# EasyEDA Pro project HUB75.eprj

# Schematic Schematic1
Board Name: Board1; Create Date: 2025-05-24; Page Name: P1; Project Name: HUB75; Schematic Name: Schematic1; Update Date: 2025-05-31; Company: 嘉立创EDA; Page Size: A4; Version: V1.0
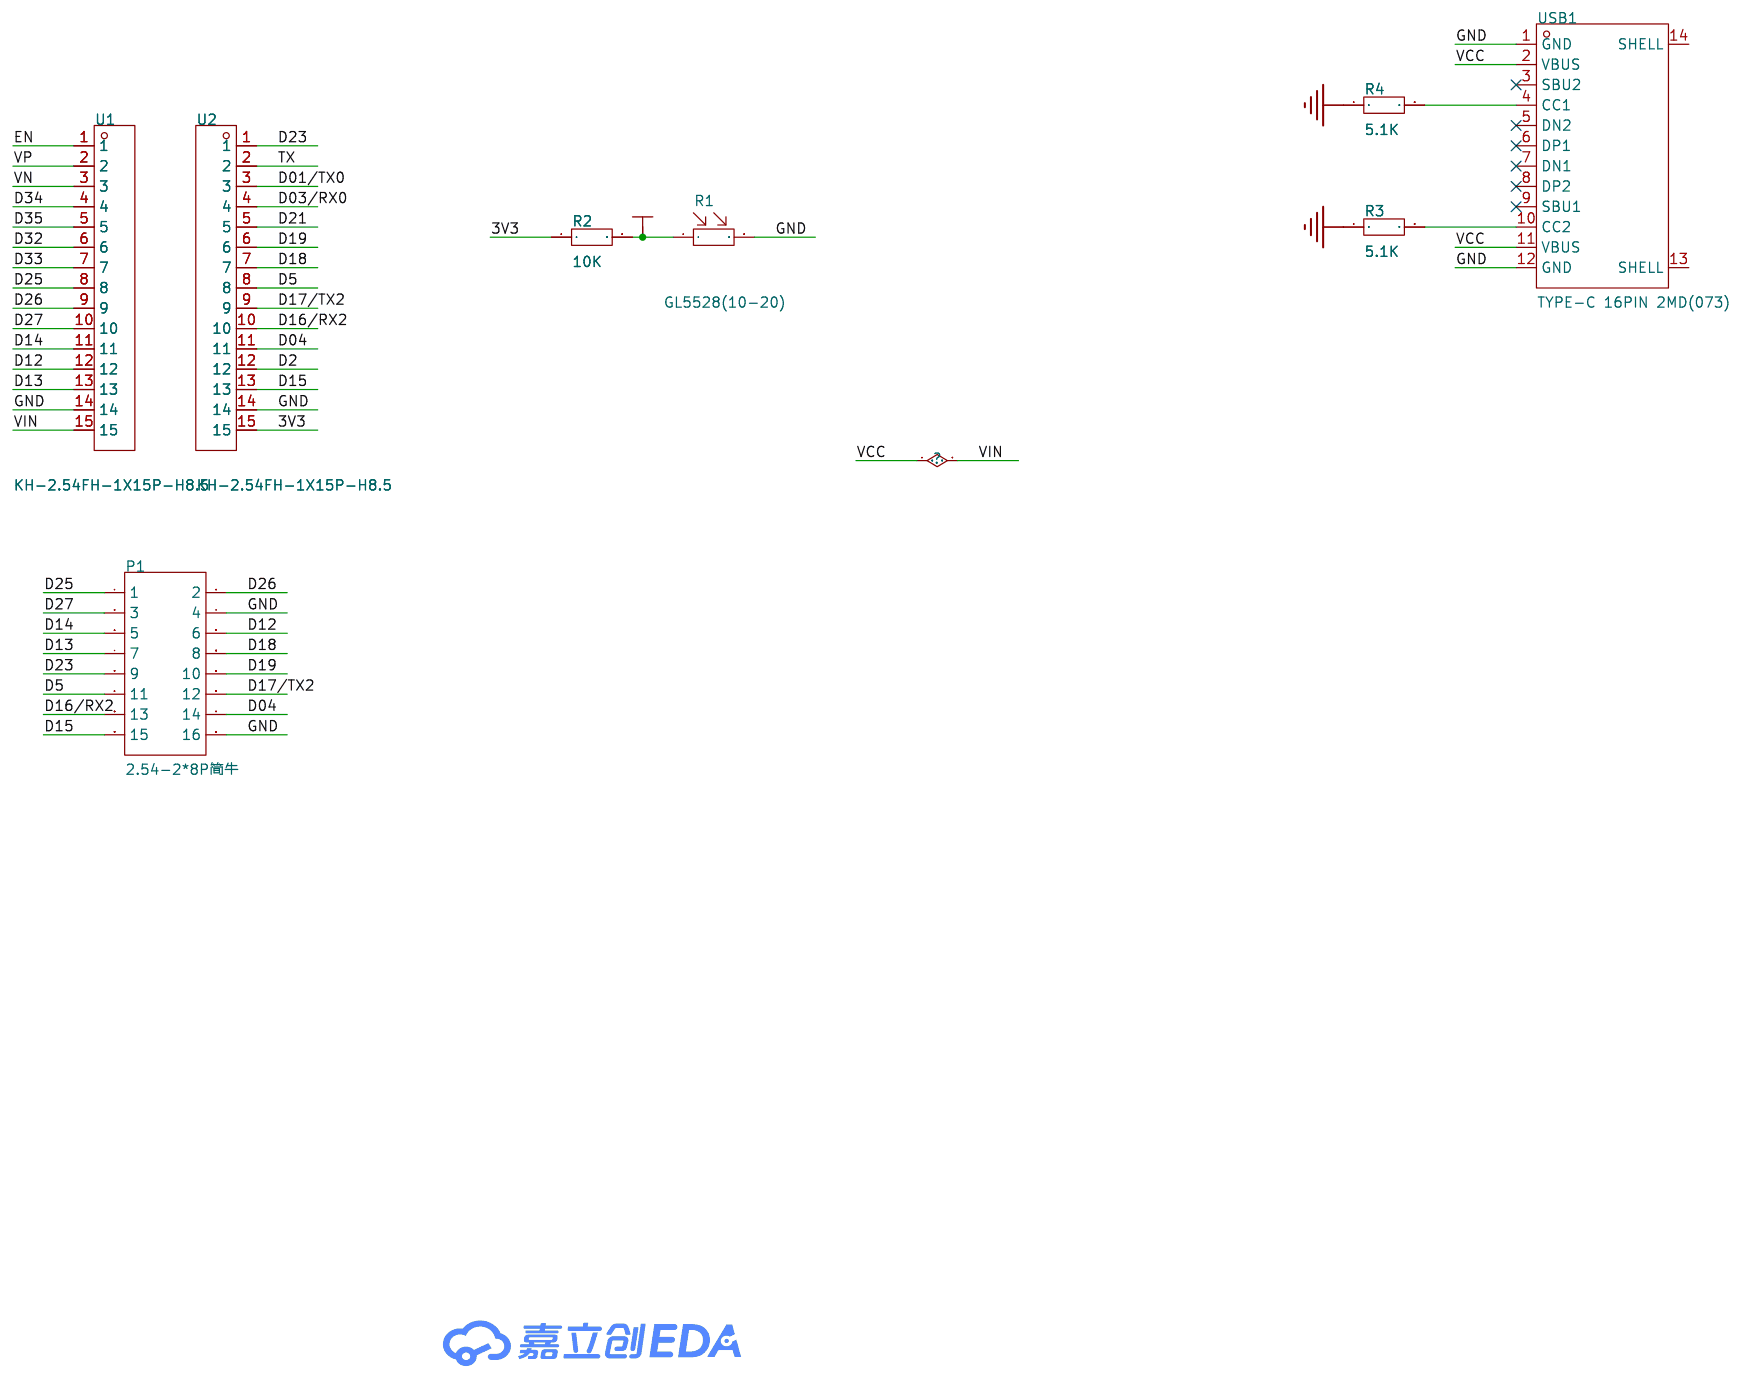
[diagram p0: schematic sheet]

## Parts
P1  2.54-2*8P简牛  [IDC-TH_16P-P2.54_C3406]
R1  GL5528(10-20)  [RES-TH_L5.1-W4.3-P3.40-D0.5]
R2  10K  [R0603]
R3  5.1K  [R0603]
R4  5.1K  [R0603]
U1  KH-2.54FH-1X15P-H8.5  [HDR-TH_15P-P2.54-V-F]
U2  KH-2.54FH-1X15P-H8.5  [HDR-TH_15P-P2.54-V-F]
USB1  TYPE-C 16PIN 2MD(073)  [USB-C-SMD_TYPE-C-6PIN-2MD-073]

## Library data of the parts
P1 = 2.54-2*8P简牛: LCSC Part Name: 2.54mm 2x8P 排数:2 每排P数:8; Supplier Part: C3406; Manufacturer: BOOMELE(博穆精密); Supplier Footprint: 插件,P=2.54mm; JLCPCB Part Class: 扩展库; Datasheet: https://atta.szlcsc.com/upload/public/pdf/source/20131122/1457706661483.pdf; Supplier: LCSC; Connector Type: 简牛座; Pitch: 2.54mm; Structure: 2x8P; Holder Type: 直插; Row Spacing: 2.54mm; Number of Rows: 2; Pin Number in each Row: 8
R1 = GL5528(10-20)_C10081: Supplier Part: C10081; Manufacturer: JCHL(晶创和立); Supplier Footprint: 插件,P=3.4mm; JLCPCB Part Class: 扩展库; Datasheet: https://atta.szlcsc.com/upload/public/pdf/source/20200417/C515010_C10502EF7F431E893A7F20DB83F527F0.pdf; Supplier: LCSC; Dark Resistance: 1MΩ; Cell Resistance @ Illuminance: 10kΩ~20kΩ; Voltage - Max: 150V; Wavelength - Peak: 540nm
R2-R4 = Res_0603: Supplier Footprint: 0603
U1 U2 = KH-2.54FH-1X15P-H8.5: LCSC Part Name: 间距:2.54mm 1x15P 直插; Supplier Part: C2932676; Manufacturer: kinghelm(金航标); Supplier Footprint: 插件,P=2.54mm; JLCPCB Part Class: 扩展库; Datasheet: https://atta.szlcsc.com/upload/public/pdf/source/20211220/977AA415CFA981E866620A80068F25CA.pdf; Supplier: LCSC; Holes Structure: 1x15P; Pitch: 2.54mm; Circular Hole / Square Hole: 方孔; Mounting Type: 直插; Number of Rows: 单排; Number of Holes: 15P; Current Rating (Max): 3A; Holes Direction: 顶部; Insulation Height: 8.5mm; Operating Temperature Range: -40℃~+105℃
USB1 = TYPE-C 16PIN 2MD(073): LCSC Part Name: Type-C 母 卧贴; Supplier Part: C2765186; Manufacturer: SHOU HAN(首韩); Supplier Footprint: SMD; Datasheet: https://atta.szlcsc.com/upload/public/pdf/source/20211123/39B17C16241EAC15C5E277BDA434118E.pdf; Supplier: LCSC; Connector Type: Type-C; Standard: USB 3.1; Gender: 母; Mounting Style: 卧贴; Number of Contacts: 16P; Number of Ports: 1; Current Rating - Power (Max): 5A; Operating Temperature Range: -25℃~+85℃; Rated Voltage (Max): 5V; Connect-Disconnect Life: 5千次; Core Colour: 黑色

## Nets
3V3: R2.1 U2.15
GND: P1.4 P1.16 R1.2 R3.1 R4.1 U1.14 U2.14 USB1.1(GND) USB1.12(GND)
VCC: U1.15 USB1.2(VBUS) USB1.11(VBUS)
D01/TX0: U2.3
D2: U2.12
D03/RX0: U2.4
D04: P1.14 U2.11
D5: P1.11 U2.8
D12: P1.6 U1.12
D13: P1.7 U1.13
D14: P1.5 U1.11
D15: P1.15 U2.13
D16/RX2: P1.13 U2.10
D17/TX2: P1.12 U2.9
D18: P1.8 U2.7
D19: P1.10 U2.6
D21: U2.5
D23: P1.9 U2.1
D25: P1.1 U1.8
D26: P1.2 U1.9
D27: P1.3 U1.10
D32: U1.6
D33: U1.7
D34: U1.4
D35: R1.1 R2.2 U1.5
EN: U1.1
TX: U2.2
VN: U1.3
VP: U1.2
$1N2046: R3.2 USB1.10(CC2)
$1N2050: R4.2 USB1.4(CC1)

Not connected (* = marked no-connect by the designer): USB1 3(SBU2)* 5(DN2)* 6(DP1)* 7(DN1)* 8(DP2)* 9(SBU1)* 13(SHELL) 14(SHELL)

# Board PCB1
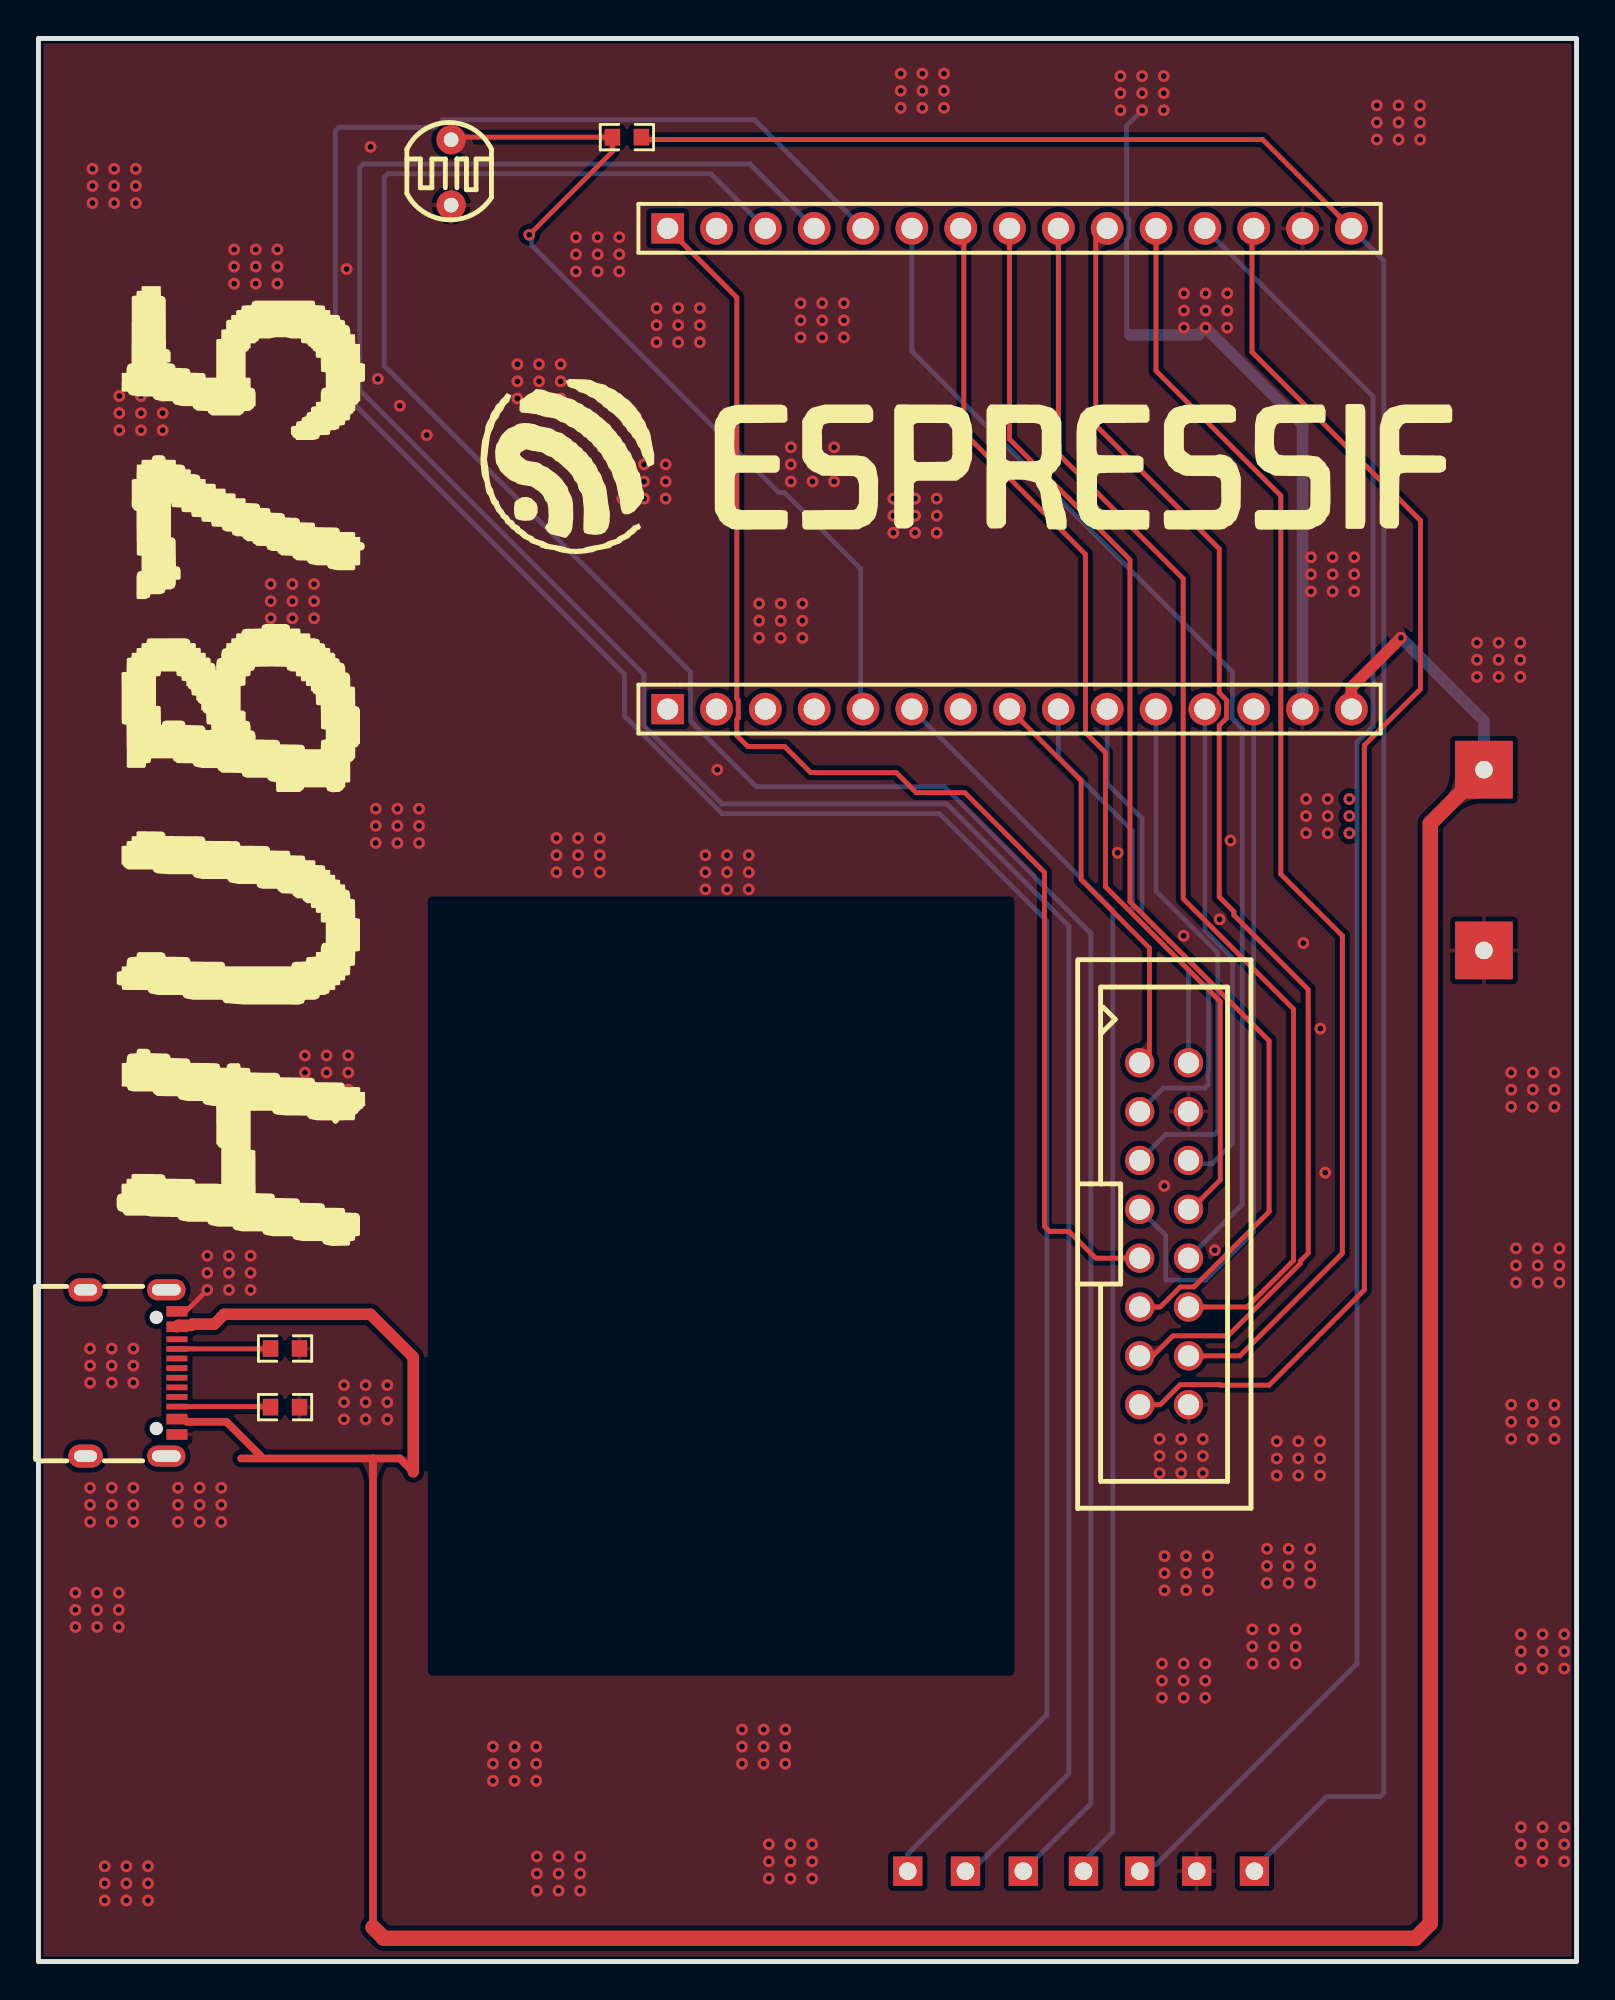
[diagram p1: board, top side]
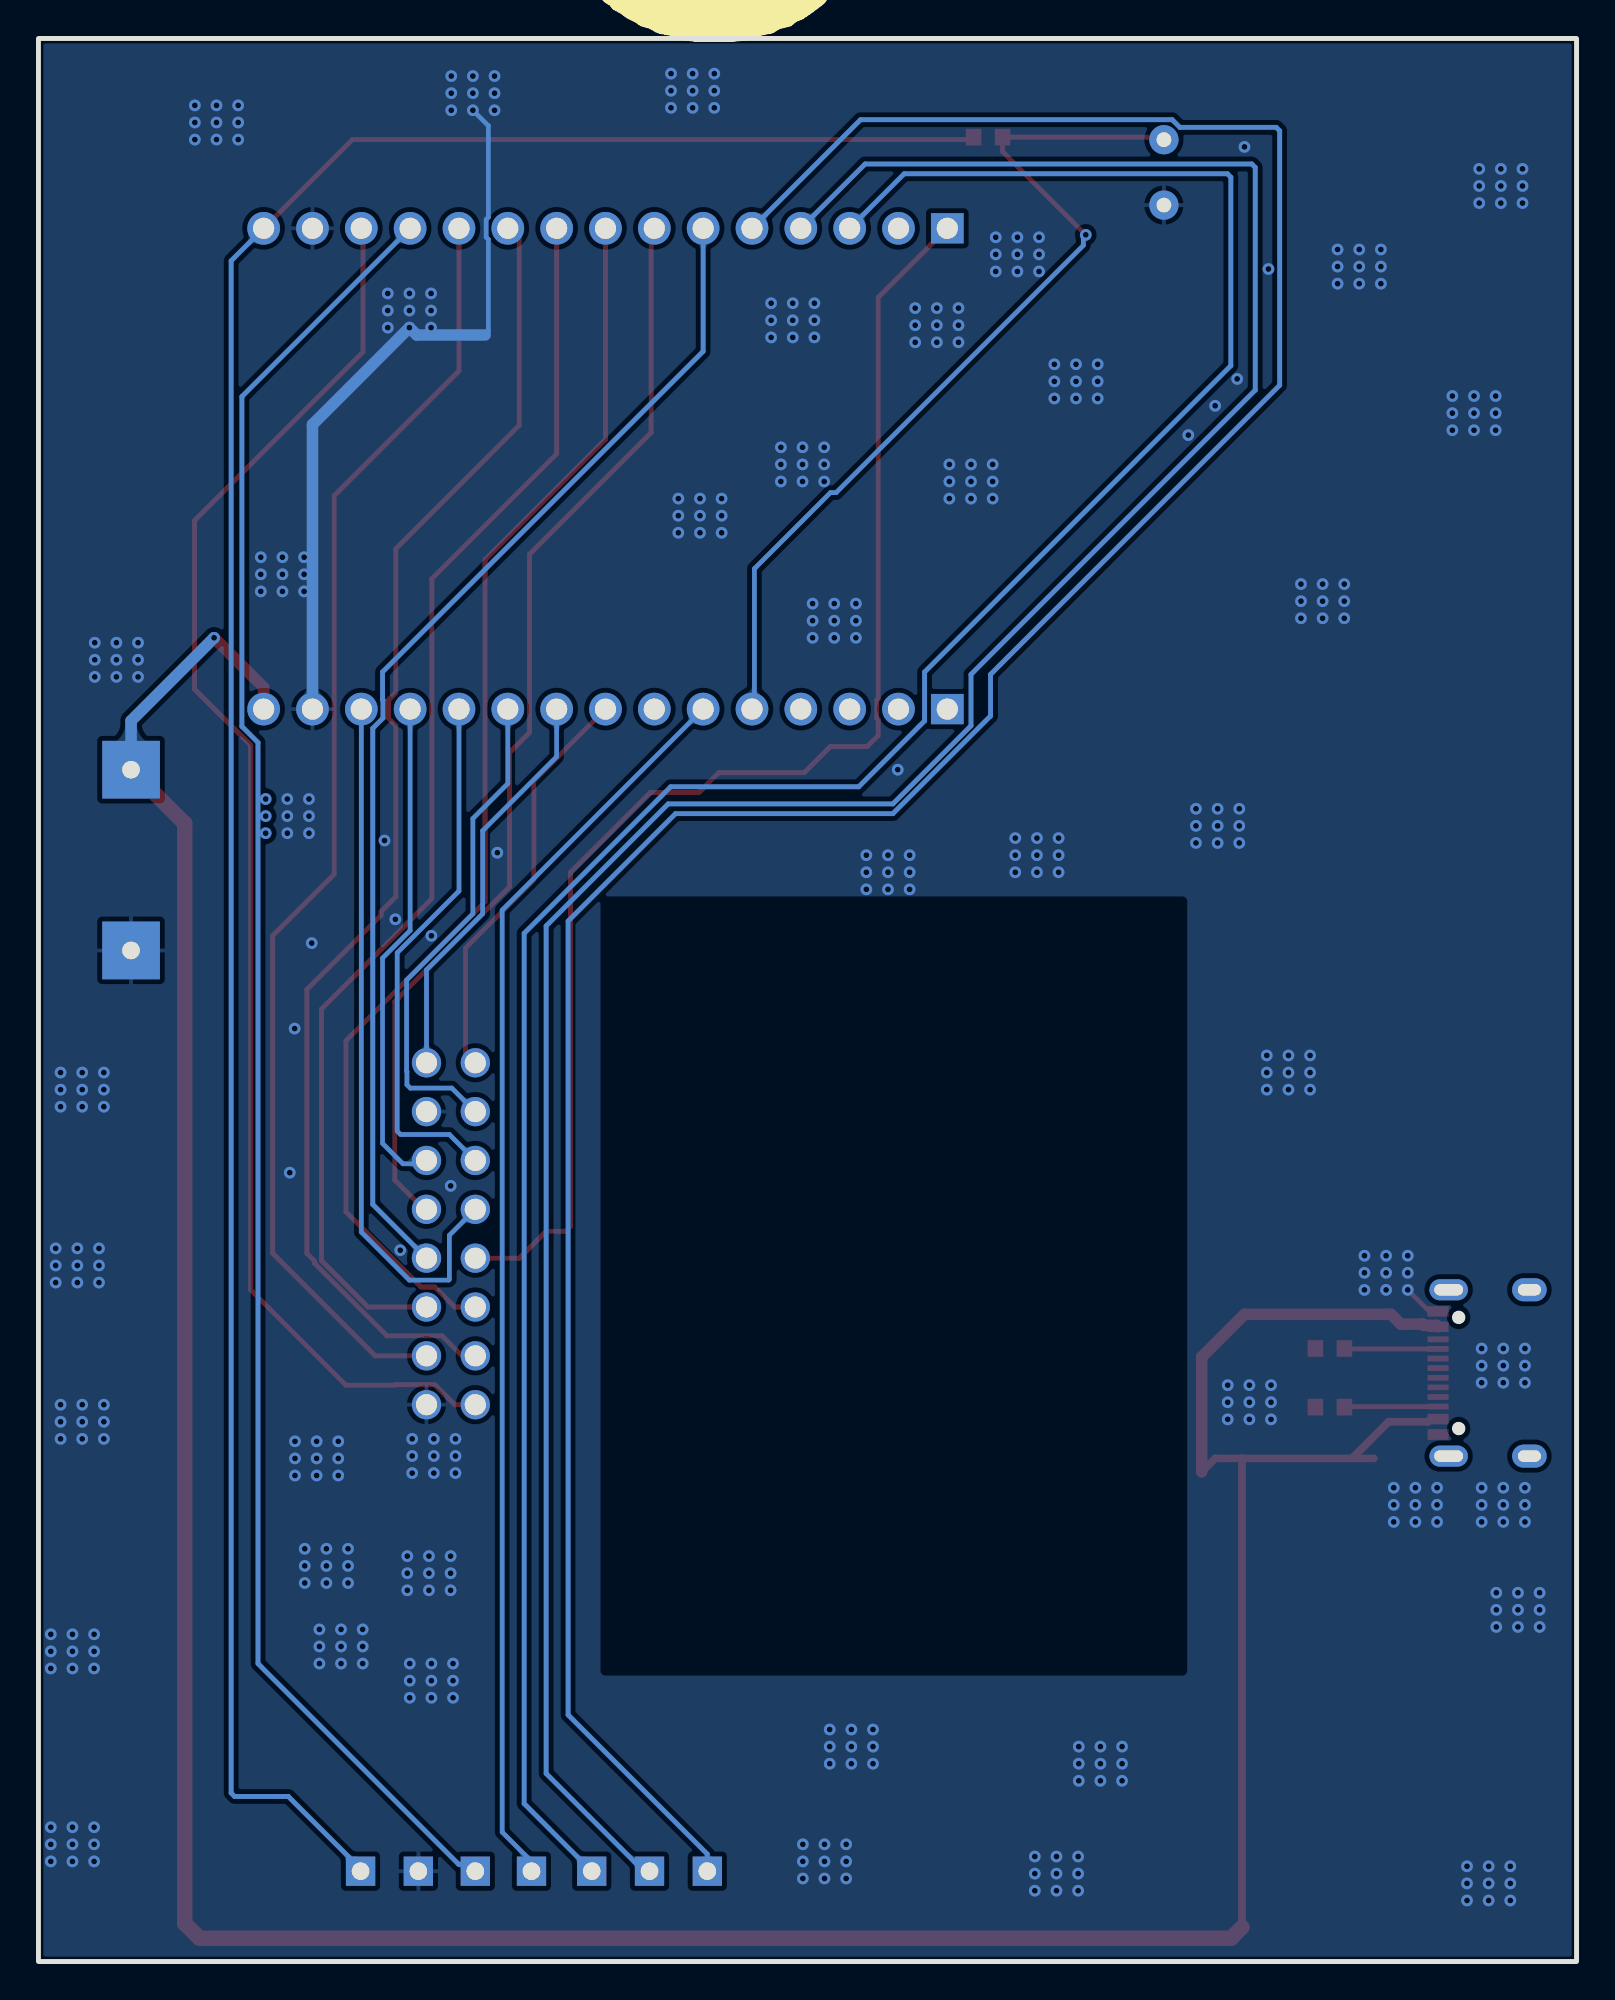
[diagram p2: board, bottom side, seen from below]

Outline 80 x 100 mm; copper layers: Top Layer, Bottom Layer. Coordinates in mm from the lower left corner of the outline.
Outline path: rectangle 0,100 80,0
Stack: Top Layer 0.035mm / Dielectric1 1.51mm FR4 er 4.5 / Bottom Layer 0.035mm

## Design rules (mm)
template: JLCPCB Capability(Two Layers Board)
spacing copperThickness1oz (default): track to track 0.102, other pairs 0.152 to 0.3
spacing copperThickness2oz: track to track 0.203, other pairs 0.152 to 0.3
track width copperThickness1oz (default): min 0.127, default 0.254, max 2.54
track width copperThickness2oz: min 0.203, default 0.254, max 2.54
differential pair differentialPair (default): width min 0.127, default 0.254, max 2.54; gap min 0.152, default 0.152
via viaSize (default): diameter min 0.5, default 0.61, max 10; hole min 0.3, default 0.305, max 6.3

## Placement (name value [footprint] x y rotation side)
NOREF  -  [Pad_e1176]  75.18 52.58 0 top
NOREF#2  -  [Pad_e431]  48.22 4.7 0 top
NOREF#3  -  [Pad_e436]  60.24 4.7 0 top
NOREF#4  -  [Pad_e515]  63.25 4.7 0 top
NOREF#5  -  [Pad_e433]  54.36 4.7 0 top
NOREF#6  -  [Pad_e435]  57.28 4.7 0 top
NOREF#7  -  [Pad_e429]  45.21 4.7 0 top
NOREF#8  -  [Pad_e432]  51.22 4.7 0 top
NOREF#9  -  [Pad_e1168]  75.18 61.98 0 top
P1  2.54-2*8P简牛  [IDC-TH_16P-P2.54_C3406]  58.55 37.85 270 top
R1  GL5528(10-20)  [RES-TH_L5.1-W4.3-P3.40-D0.5]  21.46 93.04 0 top
R2  10K  [R0603]  30.61 94.87 180 top
R3  5.1K  [R0603]  12.83 28.83 180 top
R4  5.1K  [R0603]  12.83 31.88 180 top
U1  KH-2.54FH-1X15P-H8.5  [HDR-TH_15P-P2.54-V-F]  50.51 65.13 0 top
U2  KH-2.54FH-1X15P-H8.5  [HDR-TH_15P-P2.54-V-F]  50.51 90.13 0 top
USB1  TYPE-C 16PIN 2MD(073)  [USB-C-SMD_TYPE-C-6PIN-2MD-073]  4.83 30.61 270 top

## Footprints (pads in the part's own frame, mm; a bottom-side part is the same pattern mirrored in y, then rotated)
HDR-TH_15P-P2.54-V-F
  rect 1.7x1.575 hole 1.1: 1(-17.78,0)
  round 1.7 hole 1.1: 2(-15.24,0) 3(-12.7,0) 4(-10.16,0) 5(-7.62,0) 6(-5.08,0) 7(-2.54,0) 8(0,0) 9(2.54,0) 10(5.08,0) 11(7.62,0) 12(10.16,0) 13(12.7,0) 14(15.24,0) 15(17.78,0)
IDC-TH_16P-P2.54_C3406
  round 1.524 hole 1.1: 1(-8.89,-1.27) 2(-8.89,1.27) 3(-6.35,-1.27) 4(-6.35,1.27) 5(-3.81,-1.27) 6(-3.81,1.27) 7(-1.27,-1.27) 8(-1.27,1.27) 9(1.27,-1.27) 10(1.27,1.27) 11(3.81,-1.27) 12(3.81,1.27) 13(6.35,-1.27) 14(6.35,1.27) 15(8.89,-1.27) 16(8.89,1.27)
Pad_e429
  rect 1.524x1.524 hole 0.914: 1(0,0)
Pad_e431
  rect 1.524x1.524 hole 0.914: 1(0,0)
Pad_e432
  rect 1.524x1.524 hole 0.914: 1(0,0)
Pad_e433
  rect 1.524x1.524 hole 0.914: 1(0,0)
Pad_e435
  rect 1.524x1.524 hole 0.914: 1(0,0)
Pad_e436
  rect 1.524x1.524 hole 0.914: 1(0,0)
Pad_e515
  rect 1.524x1.524 hole 0.914: 1(0,0)
Pad_e1168
  rect 3x3 hole 0.914: 1(0,0)
Pad_e1176
  rect 3x3 hole 0.914: 1(0,0)
R0603
  rect 0.806x0.864 smd: 1(-0.753,0) 2(0.753,0)
RES-TH_L5.1-W4.3-P3.40-D0.5
  round 1.524 hole 0.762: 1(0,1.7) 2(0,-1.7)
USB-C-SMD_TYPE-C-6PIN-2MD-073
  rect 0.55x1.1 smd: 1(-3.2,2.375) 2(-2.4,2.375) 11(2.4,2.375) 12(3.2,2.375)
  rect 0.3x1.1 smd: 3(-1.75,2.375) 4(-1.25,2.375) 5(-0.75,2.375) 6(-0.25,2.375) 7(0.25,2.375) 8(0.75,2.375) 9(1.25,2.375) 10(1.75,2.375)
  oval 1.1x2 hole 0.6x1.5: 13(-4.325,1.825) 14(4.325,1.825)
  oval 1.2x1.8 hole 0.6x1.2: 13(-4.325,-2.375) 14(4.325,-2.375)

## Nets
3V3: NOREF#4.1 R2.1 U2.15
GND: NOREF.1 NOREF#3.1 P1.4 P1.16 R1.2 R3.1 R4.1 U1.14 U2.14 USB1.1 USB1.12
VCC: NOREF#9.1 U1.15 USB1.2 USB1.11
D01/TX0: NOREF#8.1 U2.3
D2: NOREF#6.1 U2.12
D03/RX0: NOREF#2.1 U2.4
D04: P1.14 U2.11
D5: P1.11 U2.8
D12: P1.6 U1.12
D13: P1.7 U1.13
D14: P1.5 U1.11
D15: P1.15 U2.13
D16/RX2: P1.13 U2.10
D17/TX2: P1.12 U2.9
D18: P1.8 U2.7
D19: P1.10 U2.6
D21: NOREF#7.1 U2.5
D23: P1.9 U2.1
D25: P1.1 U1.8
D26: P1.2 U1.9
D27: P1.3 U1.10
D32: NOREF#5.1 U1.6
D33: U1.7
D34: U1.4
D35: R1.1 R2.2 U1.5
EN: U1.1
TX: U2.2
VN: U1.3
VP: U1.2
$1N2046: R3.2 USB1.10
$1N2050: R4.2 USB1.4

Pads without a net: USB1 3 5 6 7 8 9 13 14

## Via types
v1: diameter 0.61, hole 0.305, Top Layer to Bottom Layer, 422 vias

## Routing (per net, layer and track width the routed paths; a pad name or vN(x,y) marks a point on that pad's centre or on a via; arc(x,y) is an arc through that point)
3V3: length 129.2
  Top Layer w0.254: 31.62,94.74 63.67,94.74 U2.15
  Bottom Layer w0.254: 63.12,4.7 67,8.58 69.8,8.58 69.98,8.76 69.98,88.44 U2.15
GND: length 40.2
  Top Layer w0.245: USB1.1 7.66,33.81 v1(8.78,34.93)
  Bottom Layer w0.245: 56.77,84.58 56.6,84.76 56.6,89.54 56.71,89.66 56.71,90.59 56.6,90.71 56.6,95.46 v1(57.4,96.27)
  Bottom Layer w0.6: 56.77,84.58 60.33,84.58 v1(60.71,84.96) 65.75,79.92 U1.14
  vias: v1(1.92,19.18) v1(1.92,18.29) v1(1.92,17.4) v1(2.68,31.88) v1(2.68,30.99) v1(2.68,30.1) v1(2.68,24.64) v1(2.68,23.75) v1(2.68,22.86) v1(2.81,93.22) v1(2.81,92.33) v1(2.81,91.44) v1(3.05,19.18) v1(3.05,18.29) v1(3.05,17.4) v1(3.45,4.95) v1(3.45,4.06) v1(3.45,3.18) v1(3.81,31.88) v1(3.81,30.99) v1(3.81,30.1) v1(3.81,24.64) v1(3.81,23.75) v1(3.81,22.86) v1(3.94,93.22) v1(3.94,92.33) v1(3.94,91.44) v1(4.21,81.41) v1(4.21,80.52) v1(4.21,79.63) v1(4.17,19.18) v1(4.17,18.29) v1(4.17,17.4) v1(4.57,4.95) v1(4.57,4.06) v1(4.57,3.18) v1(4.94,31.88) v1(4.94,30.99) v1(4.94,30.1) v1(4.94,24.64) v1(4.94,23.75) v1(4.94,22.86) v1(5.06,93.22) v1(5.06,92.33) v1(5.06,91.44) v1(5.33,81.41) v1(5.33,80.52) v1(5.33,79.63) v1(5.7,4.95) v1(5.7,4.06) v1(5.7,3.18) v1(6.46,81.41) v1(6.46,80.52) v1(6.46,79.63) v1(7.26,24.64) v1(7.26,23.75) v1(7.26,22.86) v1(8.38,24.64) v1(8.38,23.75) v1(8.38,22.86) v1(8.78,36.7) v1(8.78,35.81) v1(9.51,24.64) v1(9.51,23.75) v1(9.51,22.86) v1(9.91,36.7) v1(9.91,35.81) v1(9.91,34.93) v1(10.18,89.03) v1(10.18,88.14) v1(10.18,87.25) v1(11.03,36.7) v1(11.03,35.81) v1(11.03,34.93) v1(11.3,89.03) v1(11.3,88.14) v1(11.3,87.25) v1(12.08,71.63) v1(12.08,70.74) v1(12.08,69.85) v1(12.43,89.03) v1(12.43,88.14) v1(12.43,87.25) v1(13.21,71.63) v1(13.21,70.74) v1(13.21,69.85) v1(13.86,47.12) v1(13.86,46.23) v1(13.86,45.34) v1(14.33,71.63) v1(14.33,70.74) v1(14.33,69.85) v1(14.99,47.12) v1(14.99,46.23) v1(14.99,45.34) v1(15.89,29.97) v1(15.89,29.08) v1(15.89,28.19) v1(16.03,88.01) v1(16.11,47.12) v1(16.11,46.23) v1(16.11,45.34) v1(17.02,29.97) v1(17.02,29.08) v1(17.02,28.19) v1(17.27,94.36) v1(17.54,59.94) v1(17.54,59.06) v1(17.54,58.17) v1(17.65,82.3) v1(18.14,29.97) v1(18.14,29.08) v1(18.14,28.19) v1(18.67,59.94) v1(18.67,59.06) v1(18.67,58.17) v1(18.8,80.9) v1(19.8,59.94) v1(19.8,59.06) v1(19.8,58.17) v1(20.19,79.38) v1(23.64,11.18) v1(23.64,10.29) v1(23.64,9.4) v1(24.77,11.18) v1(24.77,10.29) v1(24.77,9.4) v1(24.91,83.06) v1(24.91,82.17) v1(24.91,81.28) v1(25.89,11.18) v1(25.89,10.29) v1(25.89,9.4) v1(25.92,5.46) v1(25.92,4.57) v1(25.92,3.68) v1(26.03,83.06) v1(26.03,82.17) v1(26.03,81.28) v1(26.94,58.42) v1(26.94,57.53) v1(26.94,56.64) v1(27.05,5.46) v1(27.05,4.57) v1(27.05,3.68) v1(27.16,83.06) v1(27.16,82.17) v1(27.16,81.28) v1(27.96,89.66) v1(27.96,88.77) v1(27.96,87.88) v1(28.07,58.42) v1(28.07,57.53) v1(28.07,56.64) v1(28.18,5.46) v1(28.18,4.57) v1(28.18,3.68) v1(29.08,89.66) v1(29.08,88.77) v1(29.08,87.88) v1(29.19,58.42) v1(29.19,57.53) v1(29.19,56.64) v1(30.21,89.66) v1(30.21,88.77) v1(30.21,87.88) v1(30.37,77.85) v1(30.37,76.96) v1(30.37,76.07) v1(31.5,77.85) v1(31.5,76.96) v1(31.5,76.07) v1(32.15,85.98) v1(32.15,85.09) v1(32.15,84.2) v1(32.62,77.85) v1(32.62,76.96) v1(32.62,76.07) v1(33.27,85.98) v1(33.27,85.09) v1(33.27,84.2) v1(34.4,85.98) v1(34.4,85.09) v1(34.4,84.2) v1(34.69,57.53) v1(34.69,56.64) v1(34.69,55.75) v1(35.31,61.98) v1(35.81,57.53) v1(35.81,56.64) v1(35.81,55.75) v1(36.59,12.06) v1(36.59,11.18) v1(36.59,10.29) v1(36.94,57.53) v1(36.94,56.64) v1(36.94,55.75) v1(37.48,70.61) v1(37.48,69.72) v1(37.48,68.83) v1(37.72,12.06) v1(37.72,11.18) v1(37.72,10.29) v1(37.99,6.1) v1(37.99,5.21) v1(37.99,4.32) v1(38.61,70.61) v1(38.61,69.72) v1(38.61,68.83) v1(38.84,12.06) v1(38.84,11.18) v1(38.84,10.29) v1(39.13,78.74) v1(39.13,77.85) v1(39.13,76.96) v1(39.12,6.1) v1(39.12,5.21) v1(39.12,4.32) v1(39.64,86.23) v1(39.64,85.34) v1(39.64,84.46) v1(39.73,70.61) v1(39.73,69.72) v1(39.73,68.83) v1(40.24,6.1) v1(40.24,5.21) v1(40.24,4.32) v1(40.26,78.74) v1(40.26,77.85) v1(40.26,76.96) v1(40.77,86.23) v1(40.77,85.34) v1(40.77,84.46) v1(41.39,78.74) v1(41.39,77.85) v1(41.39,76.96) v1(41.89,86.23) v1(41.89,85.34) v1(41.89,84.46) v1(44.47,76.07) v1(44.47,75.18) v1(44.47,74.3) v1(44.85,98.17) v1(44.85,97.28) v1(44.85,96.39) v1(45.59,76.07) v1(45.59,75.18) v1(45.59,74.3) v1(45.97,98.17) v1(45.97,97.28) v1(45.97,96.39) v1(46.72,76.07) v1(46.72,75.18) v1(46.72,74.3) v1(47.1,98.17) v1(47.1,97.28) v1(47.1,96.39) v1(56.13,57.66) v1(56.28,98.04) v1(56.28,97.16) v1(56.28,96.27) v1(57.4,98.04) v1(57.4,97.16) v1(58.31,27.18) v1(58.31,26.29) v1(58.31,25.4) v1(58.44,15.49) v1(58.44,14.61) v1(58.44,13.72) v1(58.53,98.04) v1(58.53,97.16) v1(58.53,96.27) v1(58.56,40.33) v1(58.56,21.08) v1(58.56,20.19) v1(58.56,19.3) v1(59.44,27.18) v1(59.44,26.29) v1(59.44,25.4) v1(59.58,86.74) v1(59.58,85.85) v1(59.58,84.96) v1(59.56,53.34) v1(59.56,15.49) v1(59.56,14.61) v1(59.56,13.72) v1(59.69,21.08) v1(59.69,20.19) v1(59.69,19.3) v1(60.56,27.18) v1(60.56,26.29) v1(60.56,25.4) v1(60.71,86.74) v1(60.71,85.85) v1(60.69,15.49) v1(60.69,14.61) v1(60.69,13.72) v1(60.82,21.08) v1(60.82,20.19) v1(60.82,19.3) v1(61.18,36.99) v1(61.44,54.2) v1(61.83,86.74) v1(61.83,85.85) v1(61.83,84.96) v1(62,58.29) v1(63.14,17.27) v1(63.14,16.38) v1(63.14,15.49) v1(63.9,21.46) v1(63.9,20.57) v1(63.9,19.69) v1(64.26,17.27) v1(64.26,16.38) v1(64.26,15.49) v1(64.41,27.05) v1(64.41,26.16) v1(64.41,25.27) v1(65.02,21.46) v1(65.02,20.57) v1(65.02,19.69) v1(65.39,17.27) v1(65.39,16.38) v1(65.39,15.49) v1(65.53,27.05) v1(65.53,26.16) v1(65.53,25.27) v1(65.79,52.96) v1(65.93,60.45) v1(65.93,59.56) v1(65.93,58.67) v1(66.15,21.46) v1(66.15,20.57) v1(66.15,19.69) v1(66.18,73.03) v1(66.18,72.14) v1(66.18,71.25) v1(66.67,48.51) v1(66.66,27.05) v1(66.66,26.16) v1(66.66,25.27) v1(66.93,41.02) v1(67.06,60.45) v1(67.06,59.56) v1(67.06,58.67) v1(67.31,73.03) v1(67.31,72.14) v1(67.31,71.25) v1(68.44,73.03) v1(68.44,72.14) v1(68.44,71.25) v1(69.61,96.52) v1(69.61,95.63) v1(69.61,94.74) v1(70.74,96.52) v1(70.74,95.63) v1(70.74,94.74) v1(71.86,96.52) v1(71.86,95.63) v1(71.86,94.74) v1(74.82,68.58) v1(74.82,67.69) v1(74.82,66.8) v1(75.95,68.58) v1(75.95,67.69) v1(75.95,66.8) v1(76.6,46.23) v1(76.6,45.34) v1(76.6,44.45) v1(76.6,28.96) v1(76.6,28.07) v1(76.6,27.18) v1(76.85,37.08) v1(76.85,36.2) v1(76.85,35.31) v1(77.07,68.58) v1(77.07,67.69) v1(77.07,66.8) v1(77.11,17.02) v1(77.11,16.13) v1(77.11,15.24) v1(77.11,6.99) v1(77.11,6.1) v1(77.11,5.21) v1(77.72,46.23) v1(77.72,45.34) v1(77.72,44.45) v1(77.72,28.96) v1(77.72,28.07) v1(77.72,27.18) v1(77.98,37.08) v1(77.98,36.2) v1(77.98,35.31) v1(78.23,17.02) v1(78.23,16.13) v1(78.23,15.24) v1(78.23,6.99) v1(78.23,6.1) v1(78.23,5.21) v1(78.85,46.23) v1(78.85,45.34) v1(78.85,44.45) v1(78.85,28.96) v1(78.85,28.07) v1(78.85,27.18) v1(79.1,37.08) v1(79.1,36.2) v1(79.1,35.31) v1(79.36,17.02) v1(79.36,16.13) v1(79.36,15.24) v1(79.36,6.99) v1(79.36,6.1) v1(79.36,5.21)
VCC: length 188
  Top Layer w0.4: 17.4,26.16 17.4,1.78 ; 17.4,26.16 10.54,26.16 ; 17.4,26.16 18.8,26.16 19.49,25.46 ; 11.56,26.29 9.78,28.07 7.72,28.07 7.58,28.21
  Top Layer w0.6: v1(70.87,68.83) 68.29,66.26 U1.15 ; USB1.2 7.27,33.08 7.94,33.08 8,33.15 9.14,33.15 9.65,33.66 17.27,33.66 19.49,31.43 19.49,25.46
  Top Layer w0.8: 17.4,1.78 17.96,1.21 71.63,1.21 72.39,1.97 72.39,59.18 NOREF#9.1
  Bottom Layer w0.6: NOREF#9.1 75.18,64.52 v1(70.87,68.83)
D01/TX0: length 131.6
  Bottom Layer w0.254: U2.3 34.97,92.96 18.16,92.96 17.98,92.78 17.98,82.98 33.91,67.06 33.91,64.52 37.34,61.09 47.12,61.09 54.74,53.47 54.74,8.21 NOREF#8.1
D2: length 94.3
  Bottom Layer w0.254: U2.12 69.42,81.38 69.42,64.22 68.58,63.39 68.58,15.49 58.14,5.06 57.23,5.06
  vias: v1(68.18,60.45) v1(68.18,59.56) v1(68.18,58.67)
D03/RX0: length 138.2
  Bottom Layer w0.254: NOREF#2.1 48.51,4.7 53.59,9.78 53.59,53.85 47.24,60.2 35.56,60.2 31.5,64.26 31.5,66.93 16.71,81.71 16.71,93.29 16.89,93.47 37,93.47 U2.4
D04: length 67.5
  Top Layer w0.254: P1.14 62.48,31.5 67.82,36.83 67.82,53.34 64.62,56.54 64.62,76.22 58.13,82.72 U2.11
D5: length 65.5
  Top Layer w0.254: P1.11 58.34,34.04 59.39,35.08 60.1,35.08 64.01,38.99 64.01,47.88 56.77,55.12 56.77,72.9 50.51,79.16 U2.8
D12: length 26
  Bottom Layer w0.245: P1.6 59.99,41.48 61.04,41.48 62.1,42.55 62.1,52.18 60.67,53.61 U1.12
D13: length 37
  Bottom Layer w0.245: U1.13 63.21,37.94 60.71,35.43 58.67,35.43 58.63,35.48 58.63,37.77 P1.7
D14: length 28
  Bottom Layer w0.245: U1.11 58.13,55.66 61.34,52.45 61.34,43.18 61.17,43.01 58.63,43.01 P1.5
D15: length 74.3
  Top Layer w0.254: U2.13 63.12,90.04 63.12,83.69 71.88,74.93 71.88,66.17 68.96,63.25 68.96,34.93 64.01,29.97 61.47,29.97 61.44,30 59.39,30 58.34,28.96 P1.15
D16/RX2: length 69.7
  Top Layer w0.254: U2.10 55.21,90.13 54.99,89.91 54.99,79.88 61.42,73.46 61.42,65.98 61.8,65.59 61.8,64.66 61.42,64.28 61.42,55.36 62.18,54.6 62.18,54.41 66.04,50.55 66.04,36.83 65.63,36.42 65.63,36.3 61.87,32.54 59.01,32.54 57.96,31.5 P1.13
D17/TX2: length 65.2
  Top Layer w0.254: P1.12 62.86,34.04 65.28,36.45 65.28,49.53 59.54,55.27 59.54,71.91 53.05,78.4 U2.9
D18: length 57.2
  Top Layer w0.254: U2.7 48.13,89.96 48.13,79.5 54.46,73.18 54.46,63.91 55.5,62.87 55.5,55.88 61.47,49.92 61.47,40.64 59.94,39.12
D19: length 61.8
  Bottom Layer w0.254: U2.6 45.43,83.73 62.1,67.06 62.1,65.62 62.08,65.59 62.08,64.66 62.61,64.13 62.61,39.37 P1.10
D21: length 145.5
  Bottom Layer w0.254: U2.5 37.24,95.78 21.03,95.78 20.63,95.38 15.62,95.38 15.44,95.2 15.44,81.97 30.48,66.93 30.48,64.77 35.56,59.69 46.86,59.69 52.45,54.1 52.45,12.83 45.21,5.59 NOREF#7.1
D23: length 70.9
  Top Layer w0.254: P1.9 54.99,36.58 53.59,37.97 52.58,37.97 52.32,38.23 52.32,56.64 48.18,60.78 45.66,60.78 44.62,61.82 40.17,61.82 38.81,63.18 36.89,63.18 36.32,63.75 36.32,64.58 36.4,64.66 36.4,65.59 36.32,65.67 36.32,86.53 U2.1
D25: length 21.6
  Top Layer w0.245: U1.8 54.23,61.41 54.23,56.26 57.78,52.71 57.78,47.24 P1.1
D26: length 21.2
  Bottom Layer w0.245: P1.2 59.82,51.56 56.9,54.48 56.9,58.8 53.05,62.65 U1.9
D27: length 25.9
  Bottom Layer w0.245: U1.10 55.59,61.25 57.4,59.44 57.4,54.48 60.85,51.03 60.85,46.31 60.83,46.29 60.83,45.59 60.66,45.42 58.5,45.42 P1.3
D32: length 65.4
  Bottom Layer w0.245: U1.6 55.88,54.68 55.88,6.73 54.36,5.21 NOREF#5.1
D35: length 47.3
  Top Layer w0.245: R2.2 29.85,94.12 v1(25.53,89.79)
  Top Layer w0.254: R2.2 21.6,94.87 R1.1
  Bottom Layer w0.245: U1.5 42.89,65.38 42.76,65.51 42.76,72.43 38.81,76.38 38.51,76.38 25.65,89.24 25.65,89.66 v1(25.53,89.79)
$1N2046: length 4.5
  Top Layer w0.254: R3.2 12.05,28.86 7.58,28.86
$1N2050: length 4.5
  Top Layer w0.254: R4.2 12.05,31.86 7.58,31.86

## Copper pours and planes (outline as drawn; the poured copper is in the pictures)
GND on Top Layer: -3.3,114.94 97.28,114.94 97.28,-12.32 -3.3,-12.32
GND on Bottom Layer: -2.92,106.81 85.09,106.81 85.09,-14.22 -2.92,-14.22

Small or netless copper shapes (teardrops, artwork), in the pictures only: 33 on Top Layer, 30 on Bottom Layer
